# Altium schematic sheet 08_Extention_GPIO.SchDoc
size 420 x 297 mm; DocumentNumber: Расширитель порта; SheetNumber: 8; SheetTotal: 11
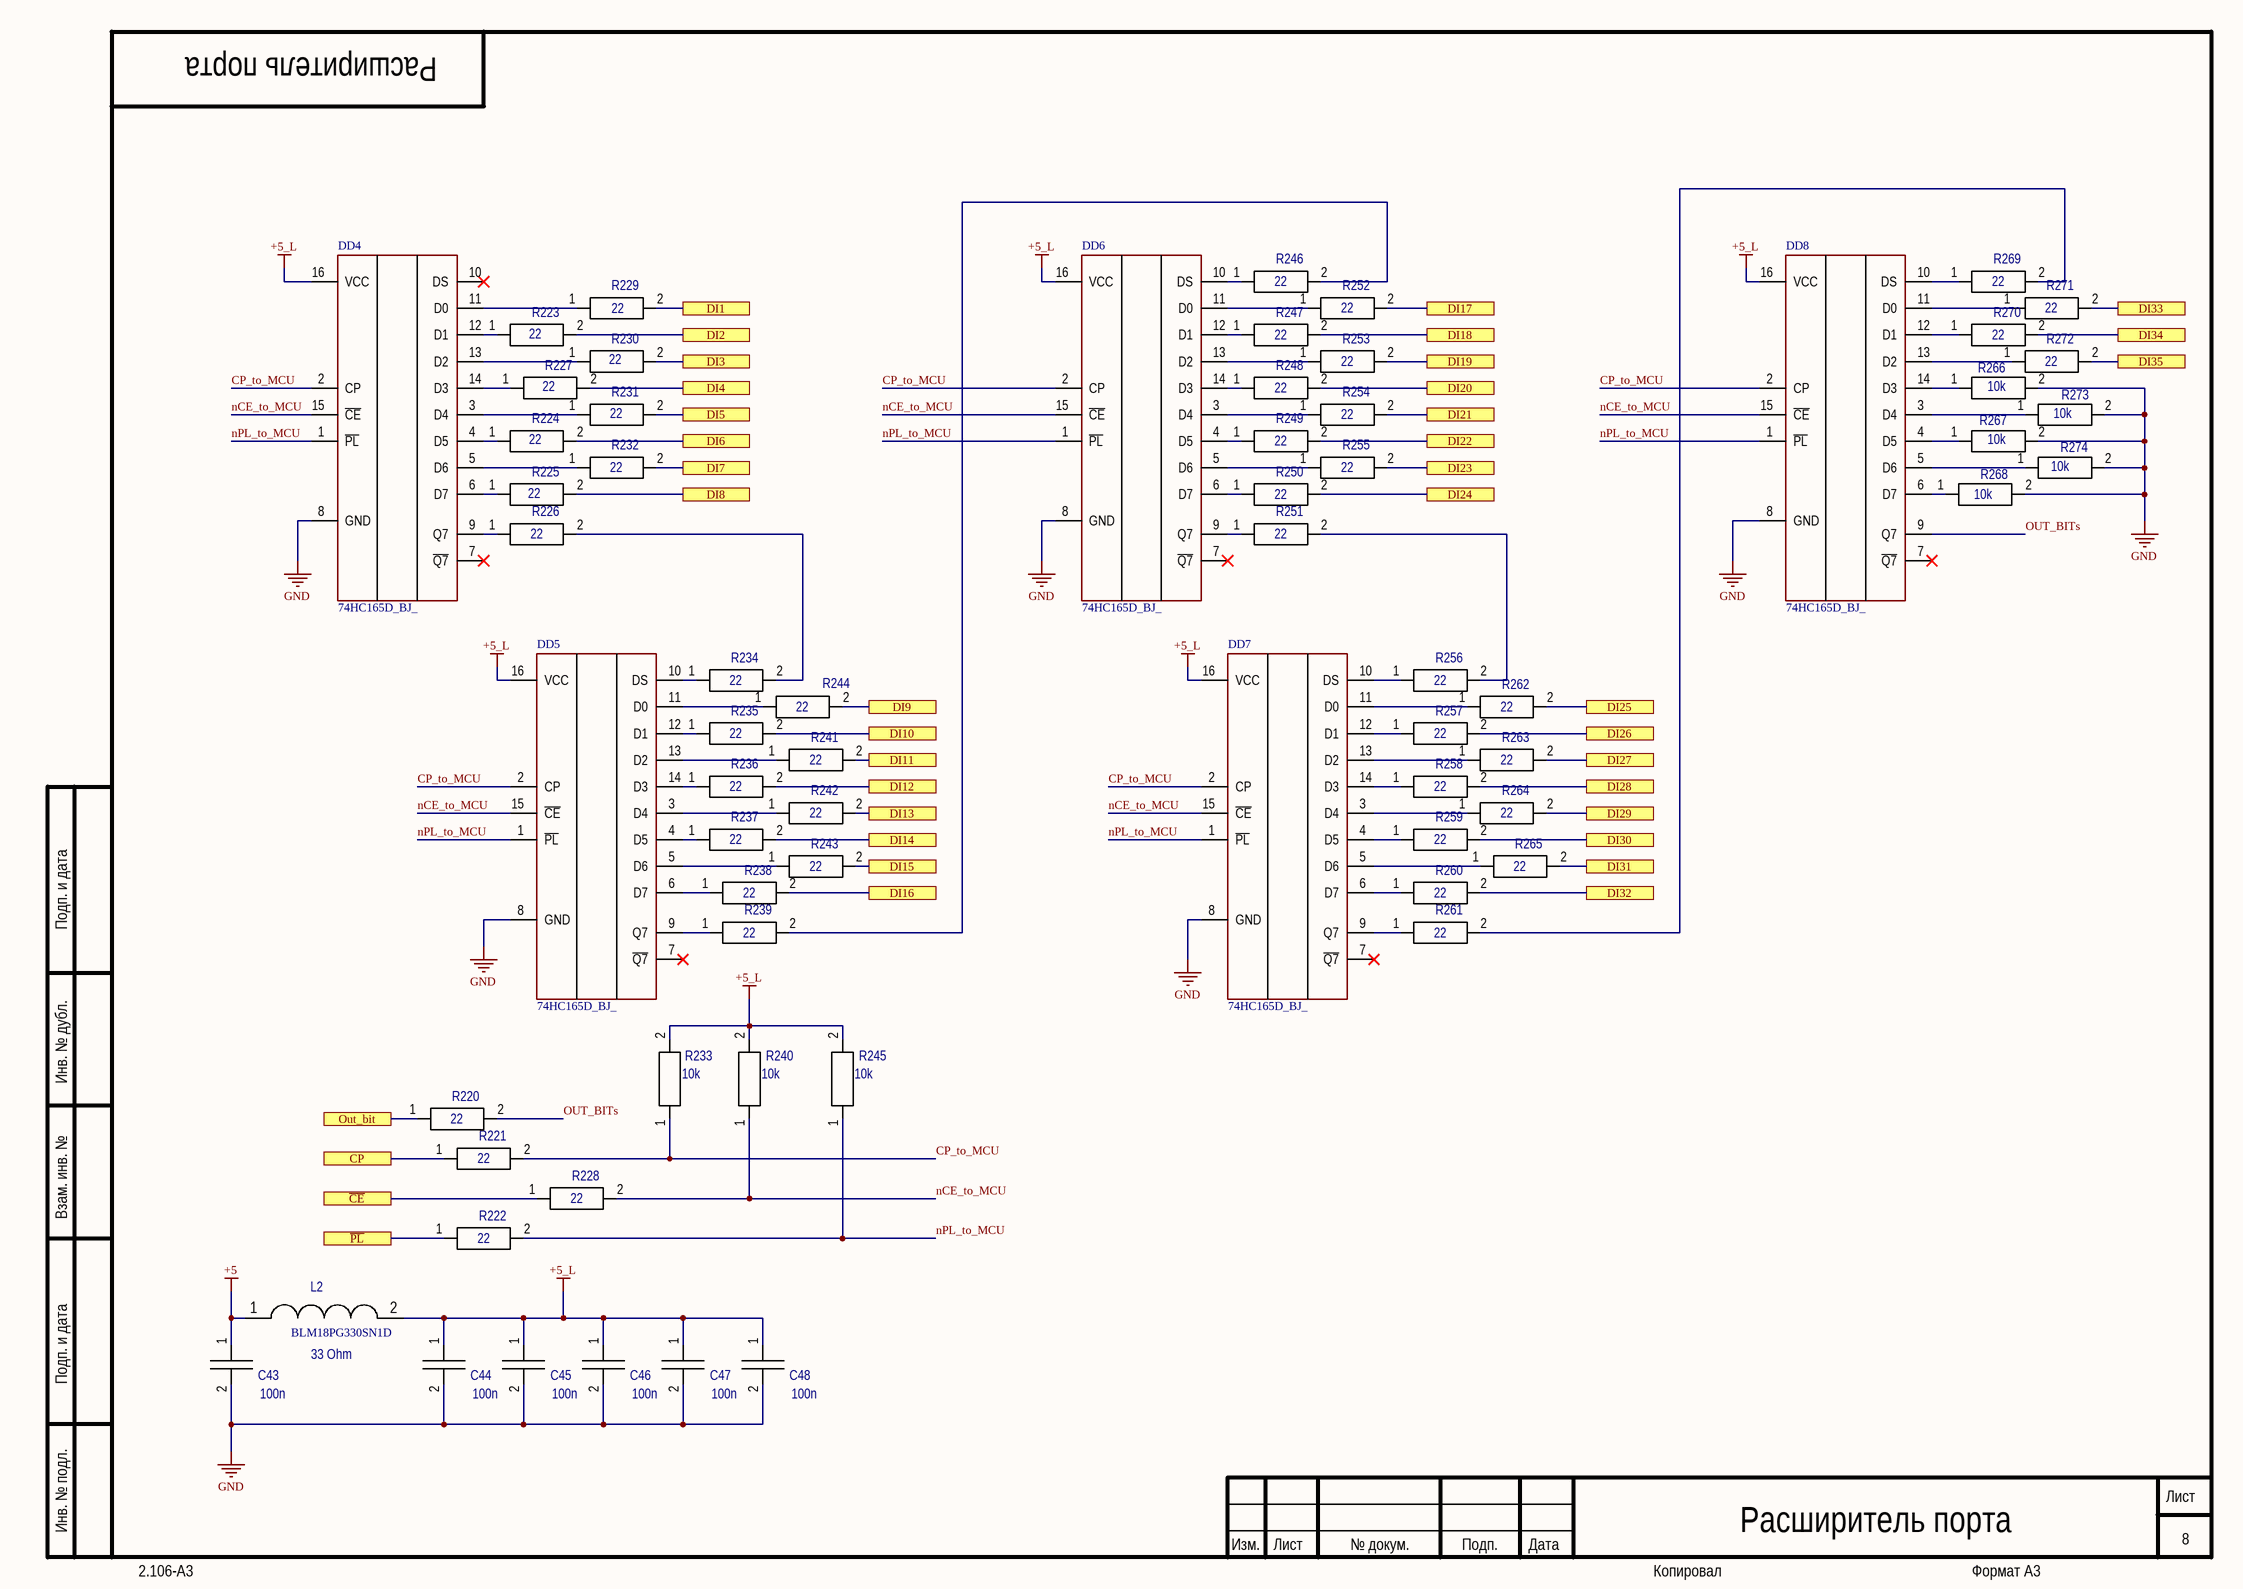
[diagram p0: 08_Extention_GPIO.SchDoc]

## Parts
C43  value 100n  [C0603]  (hidden comment: C0603)
C44  value 100n  [C0603]  (hidden comment: C0603)
C45  value 100n  [C0603]  (hidden comment: C0603)
C46  value 100n  [C0603]  (hidden comment: C0603)
C47  value 100n  [C0603]  (hidden comment: C0603)
C48  value 100n  [C0603]  (hidden comment: C0603)
DD4  74HC165D_BJ_  [SOIC127P600X175-16N]
DD5  74HC165D_BJ_  [SOIC127P600X175-16N]
DD6  74HC165D_BJ_  [SOIC127P600X175-16N]
DD7  74HC165D_BJ_  [SOIC127P600X175-16N]
DD8  74HC165D_BJ_  [SOIC127P600X175-16N]
L2  BLM18PG330SN1D  value 33 Ohm  [INDC1608N]
R220  value 22  [RESC1608N]  (hidden comment: R0603)
R221  value 22  [RESC1608N]  (hidden comment: R0603)
R222  value 22  [RESC1608N]  (hidden comment: R0603)
R223  value 22  [RESC1608N]  (hidden comment: R0603)
R224  value 22  [RESC1608N]  (hidden comment: R0603)
R225  value 22  [RESC1608N]  (hidden comment: R0603)
R226  value 22  [RESC1608N]  (hidden comment: R0603)
R227  value 22  [RESC1608N]  (hidden comment: R0603)
R228  value 22  [RESC1608N]  (hidden comment: R0603)
R229  value 22  [RESC1608N]  (hidden comment: R0603)
R230  value 22  [RESC1608N]  (hidden comment: R0603)
R231  value 22  [RESC1608N]  (hidden comment: R0603)
R232  value 22  [RESC1608N]  (hidden comment: R0603)
R233  value 10k  [RESC1608N]  (hidden comment: R0603)
R234  value 22  [RESC1608N]  (hidden comment: R0603)
R235  value 22  [RESC1608N]  (hidden comment: R0603)
R236  value 22  [RESC1608N]  (hidden comment: R0603)
R237  value 22  [RESC1608N]  (hidden comment: R0603)
R238  value 22  [RESC1608N]  (hidden comment: R0603)
R239  value 22  [RESC1608N]  (hidden comment: R0603)
R240  value 10k  [RESC1608N]  (hidden comment: R0603)
R241  value 22  [RESC1608N]  (hidden comment: R0603)
R242  value 22  [RESC1608N]  (hidden comment: R0603)
R243  value 22  [RESC1608N]  (hidden comment: R0603)
R244  value 22  [RESC1608N]  (hidden comment: R0603)
R245  value 10k  [RESC1608N]  (hidden comment: R0603)
R246  value 22  [RESC1608N]  (hidden comment: R0603)
R247  value 22  [RESC1608N]  (hidden comment: R0603)
R248  value 22  [RESC1608N]  (hidden comment: R0603)
R249  value 22  [RESC1608N]  (hidden comment: R0603)
R250  value 22  [RESC1608N]  (hidden comment: R0603)
R251  value 22  [RESC1608N]  (hidden comment: R0603)
R252  value 22  [RESC1608N]  (hidden comment: R0603)
R253  value 22  [RESC1608N]  (hidden comment: R0603)
R254  value 22  [RESC1608N]  (hidden comment: R0603)
R255  value 22  [RESC1608N]  (hidden comment: R0603)
R256  value 22  [RESC1608N]  (hidden comment: R0603)
R257  value 22  [RESC1608N]  (hidden comment: R0603)
R258  value 22  [RESC1608N]  (hidden comment: R0603)
R259  value 22  [RESC1608N]  (hidden comment: R0603)
R260  value 22  [RESC1608N]  (hidden comment: R0603)
R261  value 22  [RESC1608N]  (hidden comment: R0603)
R262  value 22  [RESC1608N]  (hidden comment: R0603)
R263  value 22  [RESC1608N]  (hidden comment: R0603)
R264  value 22  [RESC1608N]  (hidden comment: R0603)
R265  value 22  [RESC1608N]  (hidden comment: R0603)
R266  value 10k  [RESC1608N]  (hidden comment: R0603)
R267  value 10k  [RESC1608N]  (hidden comment: R0603)
R268  value 10k  [RESC1608N]  (hidden comment: R0603)
R269  value 22  [RESC1608N]  (hidden comment: R0603)
R270  value 22  [RESC1608N]  (hidden comment: R0603)
R271  value 22  [RESC1608N]  (hidden comment: R0603)
R272  value 22  [RESC1608N]  (hidden comment: R0603)
R273  value 10k  [RESC1608N]  (hidden comment: R0603)
R274  value 10k  [RESC1608N]  (hidden comment: R0603)

## Ports
CP, DI1, DI2, DI3, DI4, DI5, DI6, DI7, DI8, DI9, DI10, DI11, DI12, DI13, DI14, DI15, DI16, DI17, DI18, DI19, DI20, DI21, DI22, DI23, DI24, DI25, DI26, DI27, DI28, DI29, DI30, DI31, DI32, DI33, DI34, DI35, Out_bit, ~{CE}, ~{PL}

## Nets
+5: C43.1 L2.1
+5_L: C44.1 C45.1 C46.1 C47.1 C48.1 DD4.16(VCC) DD5.16(VCC) DD6.16(VCC) DD7.16(VCC) DD8.16(VCC) L2.2 R233.2 R240.2 R245.2
GND: C43.2 C44.2 C45.2 C46.2 C47.2 C48.2 DD4.8(GND) DD5.8(GND) DD6.8(GND) DD7.8(GND) DD8.8(GND) R266.2 R267.2 R268.2 R273.2 R274.2
~{CE}: R228.1 ; port ~{CE}
~{PL}: R222.1 ; port ~{PL}
CP: R221.1 ; port CP
CP_to_MCU: DD4.2(CP) DD5.2(CP) DD6.2(CP) DD7.2(CP) DD8.2(CP) R221.2 R233.1
DI1: R229.2 ; port DI1
DI2: R223.2 ; port DI2
DI3: R230.2 ; port DI3
DI4: R227.2 ; port DI4
DI5: R231.2 ; port DI5
DI6: R224.2 ; port DI6
DI7: R232.2 ; port DI7
DI8: R225.2 ; port DI8
DI9: R244.2 ; port DI9
DI10: R235.2 ; port DI10
DI11: R241.2 ; port DI11
DI12: R236.2 ; port DI12
DI13: R242.2 ; port DI13
DI14: R237.2 ; port DI14
DI15: R243.2 ; port DI15
DI16: R238.2 ; port DI16
DI17: R252.2 ; port DI17
DI18: R247.2 ; port DI18
DI19: R253.2 ; port DI19
DI20: R248.2 ; port DI20
DI21: R254.2 ; port DI21
DI22: R249.2 ; port DI22
DI23: R255.2 ; port DI23
DI24: R250.2 ; port DI24
DI25: R262.2 ; port DI25
DI26: R257.2 ; port DI26
DI27: R263.2 ; port DI27
DI28: R258.2 ; port DI28
DI29: R264.2 ; port DI29
DI30: R259.2 ; port DI30
DI31: R265.2 ; port DI31
DI32: R260.2 ; port DI32
DI33: R271.2 ; port DI33
DI34: R270.2 ; port DI34
DI35: R272.2 ; port DI35
nCE_to_MCU: DD4.15(~{CE}) DD5.15(~{CE}) DD6.15(~{CE}) DD7.15(~{CE}) DD8.15(~{CE}) R228.2 R240.1
nPL_to_MCU: DD4.1(~{PL}) DD5.1(~{PL}) DD6.1(~{PL}) DD7.1(~{PL}) DD8.1(~{PL}) R222.2 R245.1
Out_bit: R220.1 ; port Out_bit
OUT_BITs: DD8.9(Q7) R220.2
NetDD4_3: DD4.3(D4) R231.1
NetDD4_4: DD4.4(D5) R224.1
NetDD4_5: DD4.5(D6) R232.1
NetDD4_6: DD4.6(D7) R225.1
NetDD4_9: DD4.9(Q7) R226.1
NetDD4_11: DD4.11(D0) R229.1
NetDD4_12: DD4.12(D1) R223.1
NetDD4_13: DD4.13(D2) R230.1
NetDD4_14: DD4.14(D3) R227.1
NetDD5_3: DD5.3(D4) R242.1
NetDD5_4: DD5.4(D5) R237.1
NetDD5_5: DD5.5(D6) R243.1
NetDD5_6: DD5.6(D7) R238.1
NetDD5_9: DD5.9(Q7) R239.1
NetDD5_10: DD5.10(DS) R234.1
NetDD5_11: DD5.11(D0) R244.1
NetDD5_12: DD5.12(D1) R235.1
NetDD5_13: DD5.13(D2) R241.1
NetDD5_14: DD5.14(D3) R236.1
NetDD6_3: DD6.3(D4) R254.1
NetDD6_4: DD6.4(D5) R249.1
NetDD6_5: DD6.5(D6) R255.1
NetDD6_6: DD6.6(D7) R250.1
NetDD6_9: DD6.9(Q7) R251.1
NetDD6_10: DD6.10(DS) R246.1
NetDD6_11: DD6.11(D0) R252.1
NetDD6_12: DD6.12(D1) R247.1
NetDD6_13: DD6.13(D2) R253.1
NetDD6_14: DD6.14(D3) R248.1
NetDD7_3: DD7.3(D4) R264.1
NetDD7_4: DD7.4(D5) R259.1
NetDD7_5: DD7.5(D6) R265.1
NetDD7_6: DD7.6(D7) R260.1
NetDD7_9: DD7.9(Q7) R261.1
NetDD7_10: DD7.10(DS) R256.1
NetDD7_11: DD7.11(D0) R262.1
NetDD7_12: DD7.12(D1) R257.1
NetDD7_13: DD7.13(D2) R263.1
NetDD7_14: DD7.14(D3) R258.1
NetDD8_3: DD8.3(D4) R273.1
NetDD8_4: DD8.4(D5) R267.1
NetDD8_5: DD8.5(D6) R274.1
NetDD8_6: DD8.6(D7) R268.1
NetDD8_10: DD8.10(DS) R269.1
NetDD8_11: DD8.11(D0) R271.1
NetDD8_12: DD8.12(D1) R270.1
NetDD8_13: DD8.13(D2) R272.1
NetDD8_14: DD8.14(D3) R266.1
NetR226_2: R226.2 R234.2
NetR239_2: R239.2 R246.2
NetR251_2: R251.2 R256.2
NetR261_2: R261.2 R269.2

Not connected (* = marked no-connect by the designer): DD4 7(~{Q7})* 10(DS)*; DD5 7(~{Q7})*; DD6 7(~{Q7})*; DD7 7(~{Q7})*; DD8 7(~{Q7})*

## Notes on the sheet
- Подп. и дата
- Инв. № дубл.
- Взам. инв. №
- Инв. № подл.
- Изм.
- Лист
- № докум.
- Подп.
- Дата
- 2.106-A3
- Копировал
- Формат А3

## Library data of the parts
C43-C48 = GRM188R71C104KA01D: Manufacturer: Murata Manufacturing; Код: 22; ID: Конденсатор; Power/Voltage: 16V; Tolerance: ±10%; TKE: X7R; iii: Конденсатор GRM188R71C104KA01D 100n 16V ±10% C0603 X7R  Murata Manufacturing; Comments: C0603; Part Number: GRM188R71C104KA01D; Height: 0.9; Package: C0603; TemperatureMin: -55; TemperatureMax: 125
DD4-DD8 = 74HC165D_BJ_: Integrated Circuit; Manufacturer_Name: Toshiba; PartNumber: 74HC165D(BJ); Datasheet Link: https://www.arrow.com/en/products/74hc165d-bj/toshiba?region=nac; Height: 1.75mm; Mouser Part Number: 757-74HC165DBJ; Mouser Price/Stock: https://www.mouser.co.uk/ProductDetail/Toshiba/74HC165DBJ?qs=lQAVKuKFhkJom8fGze1o7Q%3D%3D; Arrow Part Number: 74HC165D(BJ); Arrow Price/Stock: https://www.arrow.com/en/products/74hc165d-bj/toshiba?region=nac
L2 = BLM18PG330SN1D: Код: 22; ID: Ферритовая бусина; Power/Voltage: 3A; iii: Ферритовая бусина BLM18PG330SN1D 33 Ohm 3A  L0603; Com: BLM18PG330SN1D; Part Number: BLM18PG330SN1D; Package: L0603
R220-R232 R234-R239 R241-R244 R246-R265 R269-R272 = RC0603FK-0722RL: Manufacturer: Тайвань; Код: 11; ID: Резистор; Power/Voltage: 0.063W/50V; Tolerance: ±1%; iii: Резистор RC0603FK-0722RL 22 0.063W/50V ±1% R0603  Тайвань; Comments: R0603; Part Number: RC0603FK-0722RL; Package: R0603; TemperatureMin: -55; TemperatureMax: 155
R233 R240 R245 R266-R268 R273 R274 = RC0603FK-0710KL: Part Number: RC0603FR-0710KL; Manufacturer: Тайвань; Код: 26; ID: Резистор; Power/Voltage: 0.063W/50V; Tolerance: ±1%; iii: Резистор RC0603FK-0710KL 10k 0.063W/50V ±1% R0603  Тайвань; Comments: R0603; Package: R0603; TemperatureMin: -55; TemperatureMax: 155